# Altium schematic sheet Bridge_Schem.SchDoc
size A; SheetNumber: 1; SheetTotal: 1
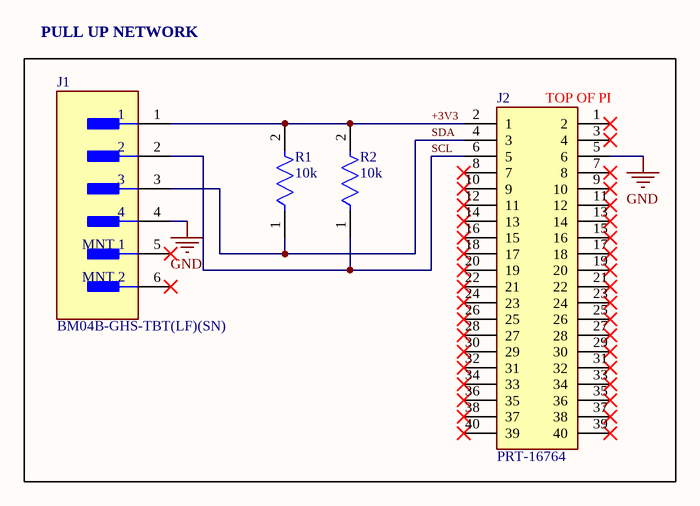
[diagram p0: Bridge_Schem.SchDoc]

## Parts
J1  BM04B-GHS-TBT(LF)(SN)  [FP-BM04B-GHS-TBT_LF_SN-MFG]
J2  PRT-16764  [RHDR40W64P254_2X20_5130X500X1375P]
R1  10k  [FP-AT0805-MFG]
R2  10k  [FP-AT0805-MFG]

## Nets
GND: J1.4 J2.5(6)
+3V3: J1.1 J2.2(1) R1.2 R2.2
SCL: J1.2 J2.6(5) R2.1
SDA: J1.3 J2.4(3) R1.1

Not connected (* = marked no-connect by the designer): J1 5(MNT_1)* 6(MNT_2)*; J2 1(2)* 3(4)* 7(8)* 8(7)* 9(10)* 10(9)* 11(12)* 12(11)* 13(14)* 14(13)* 15(16)* 16(15)* 17(18)* 18(17)* 19(20)* 20(19)* 21(22)* 22(21)* 23(24)* 24(23)* 25(26)* 26(25)* 27(28)* 28(27)* 29(30)* 30(29)* 31(32)* 32(31)* 33(34)* 34(33)* 35(36)* 36(35)* 37(38)* 38(37)* 39(40)* 40(39)*

## Notes on the sheet
- PULL UP NETWORK
- (near J2) TOP OF PI

## Library data of the parts
J1 = CMP-17439-000062-2: CONN HEADER SMD 4POS 1.25MM; Number of Positions: 4; Wire/Cable Gauge: 26AWG; Current Rating: 1A; Voltage Rating (AC): 50V; Gender: Male; Check Connector: Pending; Orientation: Straight; Max Operating Temperature: 85°C; Pitch: 1.25mm; Contact Plating: Tin; Number of Rows: 4; Series: GH; Min Operating Temperature: -25°C; REACH SVHC: No SVHC; Packaging: Cut Tape; Lead Free: Lead Free; Voltage Rating: 50V; Contact Material: Bronze; Number of Contacts: 4; Termination: Crimp; Case/Package: SMD/SMT; Housing Color: Natural; Housing Material: Nylon
J2 = PRT-16764: Connector; Manufacturer_Name: SparkFun; Datasheet Link: https://cdn.sparkfun.com/assets/0/8/d/b/2/DS-16764-2_X_20_Pin_Extended_GPIO_Header_-_Female_-_13.5mm_9.80mm.pdf; Height: 13.75mm; Manufacturer_Part_Number: PRT-16764; Mouser Part Number: 474-PRT-16764; Mouser Price/Stock: https://www.mouser.co.uk/ProductDetail/SparkFun/PRT-16764?qs=W%2FMpXkg%252BdQ4FKwyaXnhaEw%3D%3D; Arrow Part Number: PRT-16764; Arrow Price/Stock: null?region=nac
R1 R2 = CMP-03412-049031-1: Thin Film Chip Resistors Automotive Grade 10kΩ 0.5% 50ppm/°C 0805; Max Power Dissipation: 125mW; Resistance: 10kR; Ratings: AEC-Q200; Length: 0.079inch; Temperature Coefficient: 50ppm/°C; Height: 0.024inch; Min Operating Temperature: -55°C; Case/Package: 0805; Tolerance: 0.5%; RoHS Compliant: Yes; Features: Moisture Resistant; Number of Terminations: 2; Max Operating Temperature: 155°C; Series: AT; Packaging: Tape and Reel; Width: 0.049inch; Resistor Type: Thin Film